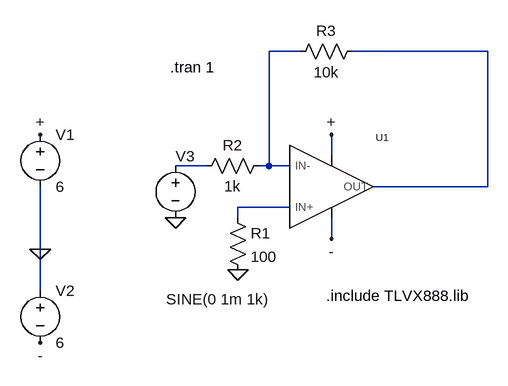
[diagram p0: schematic PruebaDeTLVx888_FUNCIONA.asc]
PruebaDeTLVx888_FUNCIONA.asc, the LTspice schematic file:
Version 4.1
SHEET 1 880 680
WIRE 176 -32 128 -32
WIRE 464 -32 256 -32
WIRE 224 128 224 96
WIRE 32 144 -16 144
WIRE 128 144 128 -32
WIRE 128 144 112 144
WIRE 160 144 128 144
WIRE 464 176 464 -32
WIRE 464 176 288 176
WIRE 160 208 80 208
WIRE 80 224 80 208
WIRE 224 256 224 224
WIRE -224 272 -224 176
WIRE -224 336 -224 272
FLAG -224 272 0
FLAG 80 304 0
FLAG -16 224 0
FLAG -224 416 -
FLAG 224 256 -
FLAG -224 96 +
FLAG 224 96 +
SYMBOL res 64 208 R0
SYMATTR InstName R1
SYMATTR Value 100
SYMBOL TLVx888 224 176 R0
SYMATTR InstName U1
SYMBOL voltage -224 80 R0
WINDOW 123 0 0 Left 0
WINDOW 39 0 0 Left 0
SYMATTR InstName V1
SYMATTR Value 6
SYMBOL voltage -224 320 R0
WINDOW 123 0 0 Left 0
WINDOW 39 0 0 Left 0
SYMATTR InstName V2
SYMATTR Value 6
SYMBOL res 128 128 R90
WINDOW 0 0 56 VBottom 2
WINDOW 3 32 56 VTop 2
SYMATTR InstName R2
SYMATTR Value 1k
SYMBOL res 272 -48 R90
WINDOW 0 0 56 VBottom 2
WINDOW 3 32 56 VTop 2
SYMATTR InstName R3
SYMATTR Value 10k
SYMBOL voltage -16 128 R0
WINDOW 0 0 1 Left 2
WINDOW 3 -14 221 Left 2
WINDOW 123 0 0 Left 0
WINDOW 39 0 0 Left 0
SYMATTR InstName V3
SYMATTR Value SINE(0 1m 1k)
TEXT 216 344 Left 2 !.include TLVX888.lib
TEXT -24 -8 Left 2 !.tran 1

The netlist it stands for:
* PruebaDeTLVx888_FUNCIONA.asc
R1 N004 0 100
X§U1 N004 N001 + - N002 TLVX888  ; pins IN+ IN- VCC VEE OUT
V1 + 0 6
V2 0 - 6
R2 N001 N003 1k
R3 N002 N001 10k
V3 N003 0 SINE(0 1m 1k)
.include TLVX888.lib
.tran 1
.backanno
.end